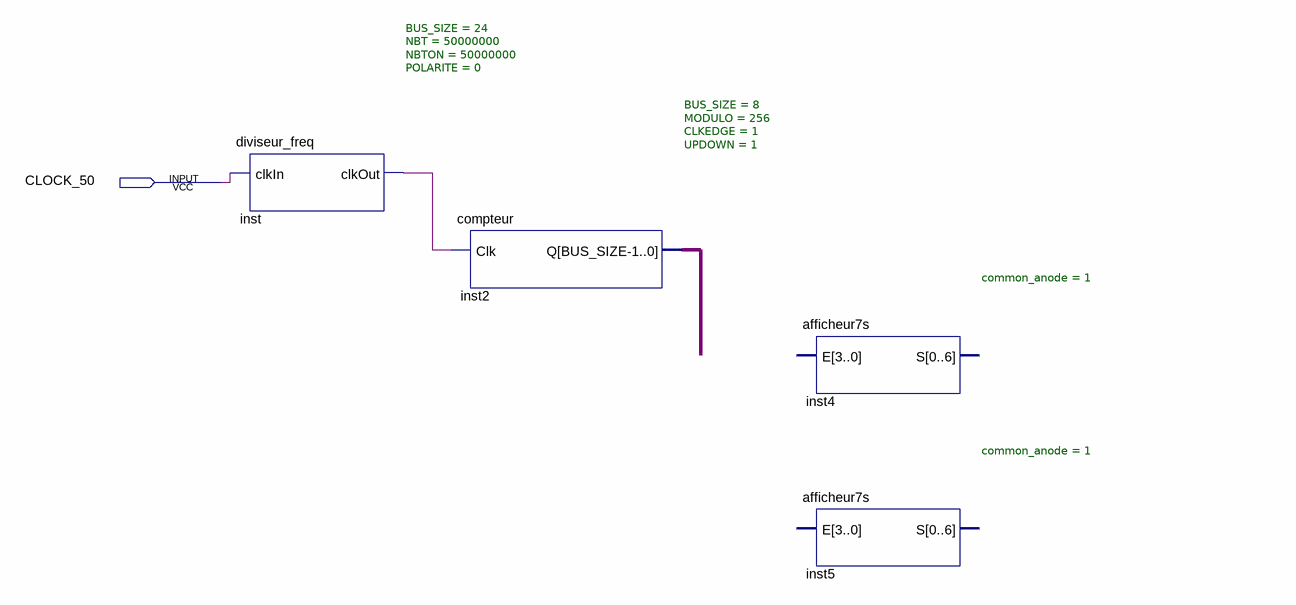
[diagram p0: schematic sheet]
// Quartus schematic AP1_EX3_afficheur7s.bdf as structural Verilog: 4 symbols, 1 pins
module AP1_EX3_afficheur7s (
  input  CLOCK_50
);

  wire inst_clkout;
  wire [7:0] inst2_q;

  diviseur_freq #(.BUS_SIZE(24), .NBT(50000000), .NBTON(50000000), .POLARITE(0)) inst (
    .clkIn(CLOCK_50), .clkOut(inst_clkout));
  compteur #(.BUS_SIZE(8), .MODULO(256), .CLKEDGE(1), .UPDOWN(1)) inst2 (.Clk(inst_clkout), .Q(inst2_q));
  afficheur7s #(.common_anode(1)) inst4 ();  // open: E, S
  afficheur7s #(.common_anode(1)) inst5 ();  // open: E, S
endmodule
